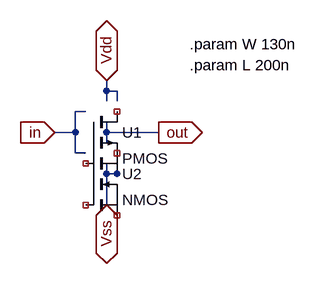
[diagram p0: schematic not.asc]
not.asc, the LTspice schematic file:
Version 4
SHEET 1 880 680
WIRE -80 -160 -80 -176
WIRE -64 -160 -80 -160
WIRE -80 -144 -80 -160
WIRE -64 -144 -64 -160
WIRE -112 -128 -128 -128
WIRE -128 -96 -128 -128
WIRE -128 -96 -160 -96
WIRE -80 -96 -80 -112
WIRE 0 -96 -80 -96
WIRE -80 -80 -80 -96
WIRE -128 -64 -128 -96
WIRE -112 -64 -128 -64
WIRE -80 -32 -80 -48
WIRE -64 -32 -64 -48
WIRE -64 -32 -80 -32
WIRE -80 16 -80 -32
FLAG 0 -96 out
IOPIN 0 -96 Out
FLAG -160 -96 in
IOPIN -160 -96 In
FLAG -80 16 Vss
IOPIN -80 16 BiDir
FLAG -80 -176 Vdd
IOPIN -80 -176 BiDir
SYMBOL pmos -112 -128 R0
SYMATTR InstName U1
SYMATTR SpiceLine W={W} L={L}
SYMBOL nmos -112 -64 R0
SYMATTR InstName U2
SYMATTR SpiceLine W={W} L={L}
TEXT 48 -232 Left 2 !.param W 130n
TEXT 48 -200 Left 2 !.param L 200n

The netlist it stands for:
* not.asc
* U1: PMOS W={W} L={L} (symbol pmos not certain, pin order unknown); nets seen at it: Vss
* U2: NMOS W={W} L={L} (symbol nmos not certain, pin order unknown); nets seen at it: 
.param W 130n
.param L 200n
.backanno
.end